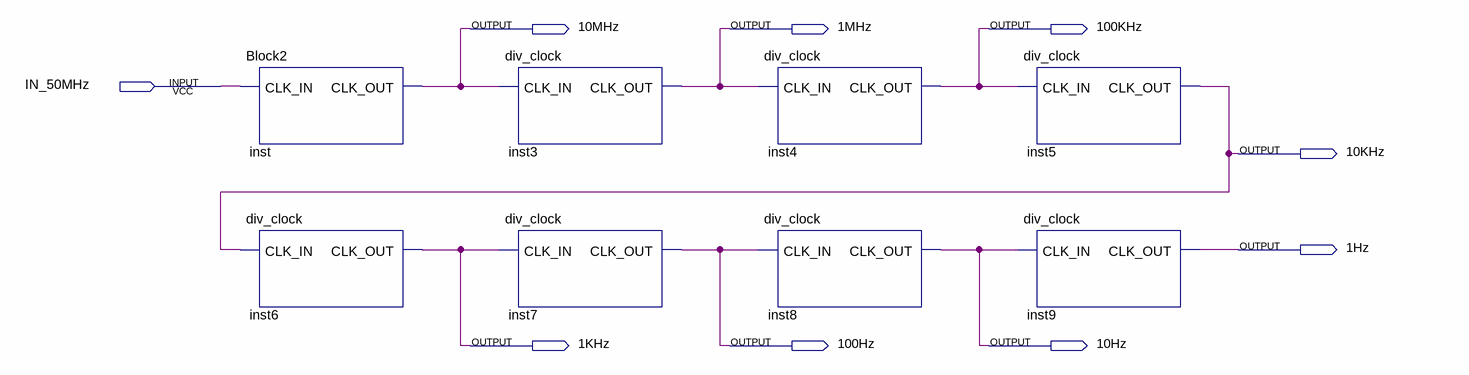
[diagram p0: schematic sheet]
// Quartus schematic Block3.bdf as structural Verilog: 8 symbols, 9 pins
module Block3 (
  input  IN_50MHz,
  output \10MHz ,
  output \1MHz ,
  output \100KHz ,
  output \10KHz ,
  output \1Hz ,
  output \1KHz ,
  output \100Hz ,
  output \10Hz 
);

  Block2 inst (.CLK_IN(IN_50MHz), .CLK_OUT(\10MHz ));
  div_clock inst6 (.CLK_IN(\10KHz ), .CLK_OUT(\1KHz ));
  div_clock inst3 (.CLK_IN(\10MHz ), .CLK_OUT(\1MHz ));
  div_clock inst7 (.CLK_IN(\1KHz ), .CLK_OUT(\100Hz ));
  div_clock inst4 (.CLK_IN(\1MHz ), .CLK_OUT(\100KHz ));
  div_clock inst8 (.CLK_IN(\100Hz ), .CLK_OUT(\10Hz ));
  div_clock inst5 (.CLK_IN(\100KHz ), .CLK_OUT(\10KHz ));
  div_clock inst9 (.CLK_IN(\10Hz ), .CLK_OUT(\1Hz ));
endmodule
